# EAGLE design Attenuverting Mixer Slim main v1 (EAGLE 7.7.0)
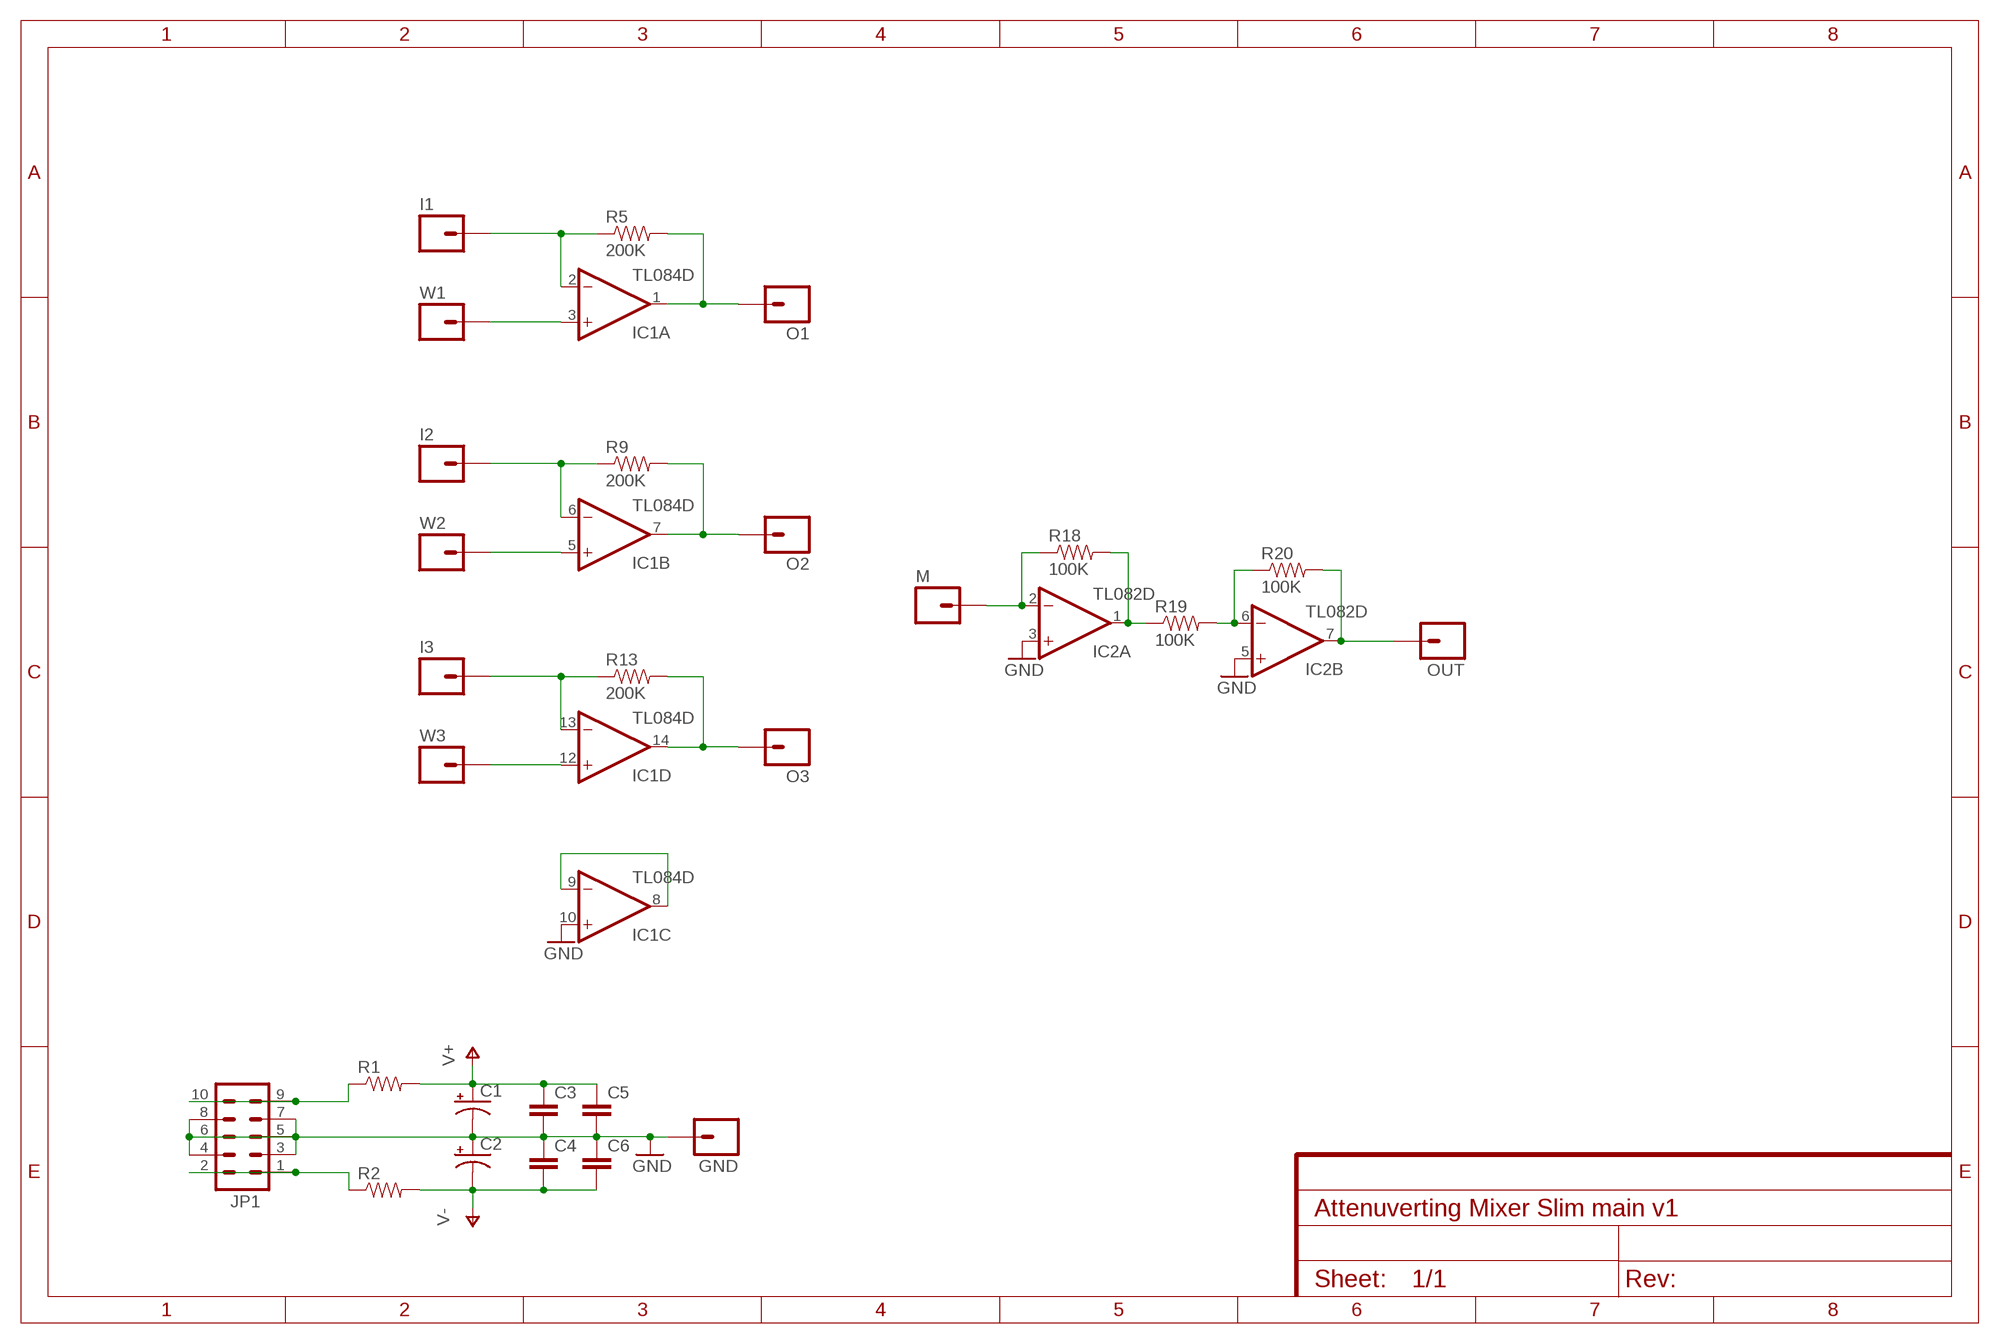
[diagram p0: schematic, sheet 1]

## Parts
C1  CAP_POLC  [PANASONIC_C]
C2  CAP_POLC  [PANASONIC_C]
C3  CAP0603-CAP  [0603-CAP]
C4  CAP0603-CAP  [0603-CAP]
C5  CAP0603-CAP  [0603-CAP]
C6  CAP0603-CAP  [0603-CAP]
GND  M01PTH  [1X01]
I1  M01PTH  [1X01]
I2  M01PTH  [1X01]
I3  M01PTH  [1X01]
IC1  TL084D  [SO14]
IC2  TL082D  [SO08]
JP1  M05X2PTH  [AVR_ICSP]
M  M01PTH  [1X01]
O1  M01PTH  [1X01]
O2  M01PTH  [1X01]
O3  M01PTH  [1X01]
OUT  M01PTH  [1X01]
R1  RESISTOR0805-RES  [0805]
R2  RESISTOR0805-RES  [0805]
R5  200K  RESISTOR0603-RES  [0603-RES]
R9  200K  RESISTOR0603-RES  [0603-RES]
R13  200K  RESISTOR0603-RES  [0603-RES]
R18  100K  RESISTOR0603-RES  [0603-RES]
R19  100K  RESISTOR0603-RES  [0603-RES]
R20  100K  RESISTOR0603-RES  [0603-RES]
W1  M01PTH  [1X01]
W2  M01PTH  [1X01]
W3  M01PTH  [1X01]

## Nets
GND: C1.- C2.+ C3.2 C4.1 C5.2 C6.1 GND.1 IC1.10(C:+IN) IC2.3(A:+IN) IC2.5(B:+IN) JP1.3 JP1.4 JP1.5 JP1.6 JP1.7 JP1.8
N$1: IC1.3(A:+IN) W1.1
N$2: I1.1 IC1.2(A:-IN) R5.1
N$3: JP1.1 JP1.2 R2.1
N$4: JP1.9 JP1.10 R1.1
N$8: IC1.1(A:OUT) O1.1 R5.2
N$9: IC1.5(B:+IN) W2.1
N$10: IC1.12(D:+IN) W3.1
N$11: I2.1 IC1.6(B:-IN) R9.1
N$13: IC1.7(B:OUT) O2.1 R9.2
N$16: I3.1 IC1.13(D:-IN) R13.1
N$17: IC1.14(D:OUT) O3.1 R13.2
N$21: IC2.2(A:-IN) M.1 R18.1
N$22: IC2.1(A:OUT) R18.2 R19.1
N$23: IC2.6(B:-IN) R19.2 R20.1
N$24: IC2.7(B:OUT) OUT.1 R20.2
N$26: IC1.8(C:OUT) IC1.9(C:-IN)
V+: C1.+ C3.1 C5.1 R1.2
V-: C2.- C4.2 C6.2 R2.2

## Power pins joined to a net without a drawn wire
V+: IC1.4(P:V+) IC2.8(P:V+)
V-: IC1.11(P:V-) IC2.4(P:V-)

## Library data of the parts
C1 C2 = SparkFun-Capacitors:CAP_POL: Capacitor Polarized These are standard SMD and PTH capacitors. Normally 10uF, 47uF, and 100uF in electrolytic and tantalum varieties. Always verify the external diameter of the through hole cap, it varies with capacity, voltage, and manufacturer. The EIA devices should be standard.
C3-C6 = SparkFun-Passives:CAP: Capacitor Standard 0603 ceramic capacitor, and 0.1" leaded capacitor.
GND I1-I3 M O1-O3 OUT W1-W3 = SparkFun-Connectors:M01: Header 1 Standard 1-pin 0.1" header. Use with straight break away headers (SKU : PRT-00116), right angle break away headers (PRT-00553), swiss pins (PRT-00743), machine pins (PRT-00117), and female headers (PRT-00115).
IC1 = linear:TL084: OP AMP
IC2 = linear:TL082: OP AMP Data sheet <http://www.ti.com/lit/ds/symlink/tl084a . pdf>; DATA_SHEET: <a href="http://www.ti.com/lit/ds/symlink/tl084a.pdf"> Data sheet </a>
JP1 = SparkFun-Connectors:M05X2: Header 5x2 Standard 10-pin dual row 0.1" header. Commonly used with AVR-ISP. Use with Spark Fun Electronics SKU: PRT-00778
R1 R2 = SparkFun-Resistors:RESISTOR: Resistor Basic schematic elements and footprints for 0603, 1206, and PTH resistors.
R5 R9 R13 R18-R20 = SparkFun-Passives:RESISTOR: Resistor Basic schematic elements and footprints for 0603, 1206, and PTH resistors.

## Board
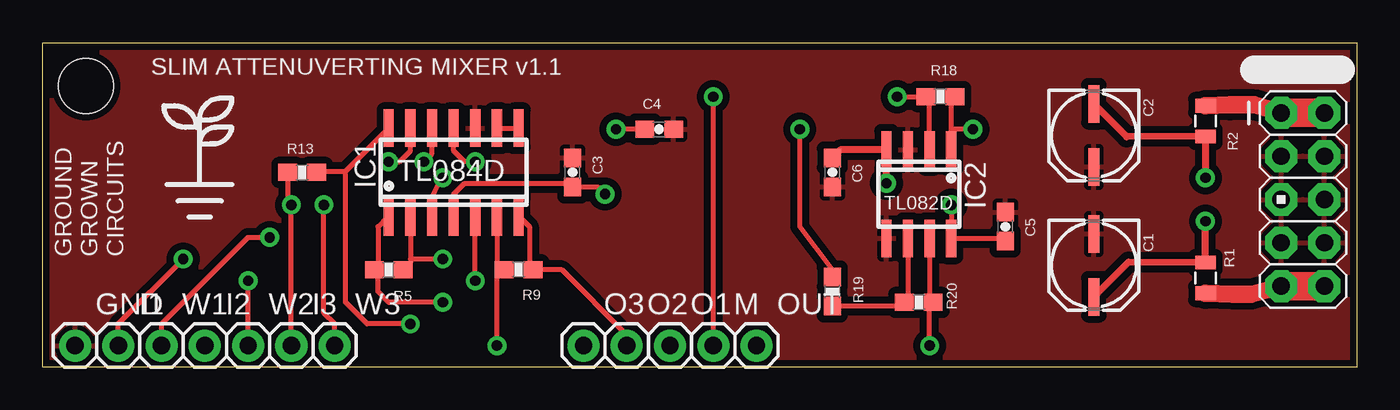
[diagram p1: board, top side]
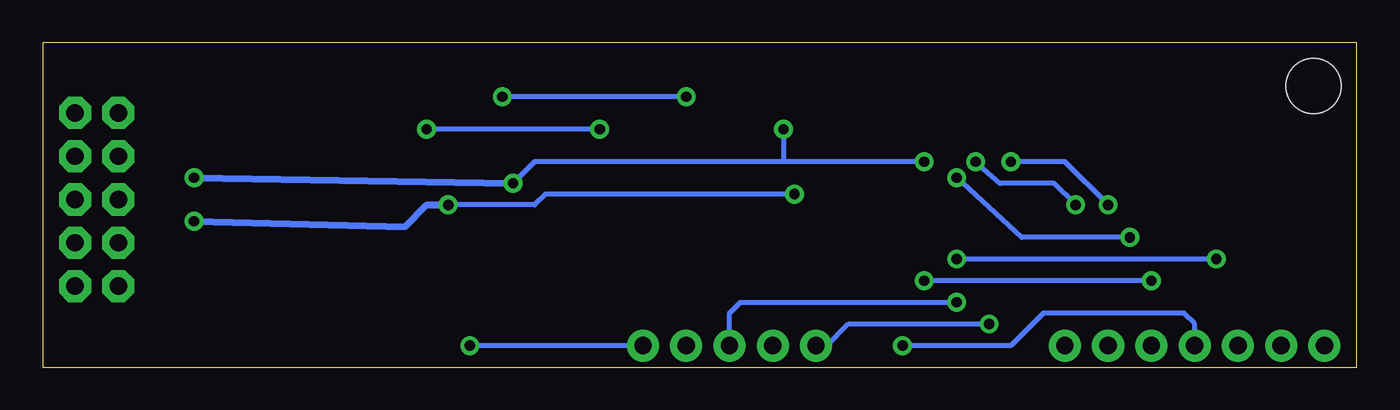
[diagram p2: board, bottom side, seen from below]

Size 77.15 x 19.05 mm. Coordinates in mm from the lower left corner, seen from the top.
Outline: 0,0 0,19.05 77.15,19.05 77.15,0 0,0
Copper layers (1*16): Top 0.035mm / dielectric 1.5mm / Bottom 0.035mm
Design rules "SparkFun": minimum track width 8mil, minimum drill 20mil, track to track 8mil, track to pad 8mil, pad to pad 8mil, via to via 8mil, smd to smd 8mil, copper to edge 8mil, drill to drill 8mil, minimum pad ring 12mil, minimum via ring 10mil, stop-mask expansion 4mil, vias tented up to drill 20mil, thermal gap 10mil
Holes 3.2 mm at 2.54,16.51

### Footprints (pad centres in the part's own frame; a part is rotated, then mirrored left to right if it is on the bottom)
PANASONIC_C = smd 2.2 x 0.65: + 1.9,-0.2; - -1.8,-0.2
0603-CAP = smd 1.1 x 1: 1 -0.85,0; 2 0.85,0
1X01 = drill 1.016 pad 1.88: 1 0,0
SO14 = smd 0.6 x 2.2: 1 -3.81,-2.6; 2 -2.54,-2.6; 3 -1.27,-2.6; 4 0,-2.6; 5 1.27,-2.6; 6 2.54,-2.6; 7 3.81,-2.6; 8 3.81,2.6; 9 2.54,2.6; 10 1.27,2.6; 11 0,2.6; 12 -1.27,2.6; 13 -2.54,2.6; 14 -3.81,2.6
SO08 = smd 0.6 x 2.2: 1 -1.905,-2.6; 2 -0.635,-2.6; 3 0.635,-2.6; 4 1.905,-2.6; 5 1.905,2.6; 6 0.635,2.6; 7 -0.635,2.6; 8 -1.905,2.6
AVR_ICSP = drill 1.016 pad 1.88 octagon: 1 -1.27,5.08; 2 1.27,5.08; 3 -1.27,2.54; 4 1.27,2.54; 5 -1.27,0; 6 1.27,0; 7 -1.27,-2.54; 8 1.27,-2.54; 9 -1.27,-5.08; 10 1.27,-5.08
0805 = smd 0.8 x 1.2: 1 -0.9,0; 2 0.9,0
0603-RES = smd 1.1 x 1: 1 -0.85,0; 2 0.85,0

### Placement (x,y rotation side)
C1  61.91,6.03 270 top
C2  61.91,13.65 270 top
C3  31.11,11.43 90 top
C4  36.2,13.97 180 top
C5  56.52,8.26 90 top
C6  46.36,11.43 90 top
GND  1.91,1.27 0 top
I1  4.44,1.27 0 top
I2  9.53,1.27 0 top
I3  14.61,1.27 0 top
IC1  24.13,11.43 0 top
IC2  51.44,10.16 180 top
JP1  73.98,9.84 0 top
M  39.37,1.27 0 top
O1  36.83,1.27 0 top
O2  34.29,1.27 0 top
O3  31.75,1.27 0 top
OUT  41.91,1.27 0 top
R1  68.26,5.24 90 top
R2  68.26,14.45 270 top
R5  20.32,5.71 180 top
R9  27.94,5.71 0 top
R13  15.24,11.43 0 top
R18  52.71,15.88 0 top
R19  46.36,4.44 270 top
R20  51.44,3.81 0 top
U$1  [LOGO_SMALL]  9.21,10.79 0 top
W1  6.98,1.27 0 top
W2  12.07,1.27 0 top
W3  17.14,1.27 0 top

### Tracks (layer width: path | path; a pad name or v marks a point on that pad's centre or on a via)
GND
  pour Top (isolate 0.406): 0.32,0 0.32,19.05 77.15,19.05 77.15,0
N$1  (via drill 0.6)
  Top 0.305: W1.1 6.99,2.54 12.07,7.62 v13.34,7.62 | v23.5,11.11 23.18,10.64 22.86,10 IC1.3
  Bottom 0.305: v13.34,7.62 19.69,7.62 v23.5,11.11
N$2  (via drill 0.6)
  Top 0.305: IC1.2 21.59,6.35 | 21.59,6.35 21.59,6.14 R5.1 | I1.1 4.45,2.54 v8.26,6.35 | v23.5,6.35 21.59,6.35
  Bottom 0.305: v8.26,6.35 v23.5,6.35
N$3
  Top 1.016: JP1.1 71.12,15.4 69.72,15.4 R2.1
  Top 1.676: JP1.2 JP1.1
N$4
  Top 1.016: JP1.9 70.96,4.29 69.88,4.29 R1.1
  Top 1.676: JP1.10 JP1.9
N$8  (via drill 0.6)
  Top 0.305: IC1.1 20.26,8.83 19.69,8.26 19.69,5.93 R5.2 19.69,5.5 19.69,4.45 20.32,3.81 v23.5,3.81
  Bottom 0.305: O1.1 36.83,3.18 36.2,3.81 v23.5,3.81
N$9  (via drill 0.6)
  Top 0.305: W2.1 v12.07,5.08 | v25.4,5.08 IC1.5
  Bottom 0.305: v12.07,5.08 v25.4,5.08
N$10  (via drill 0.6)
  Top 0.305: v22.38,12.07 22.86,12.54 IC1.12 | W3.1 17.15,2.54 16.51,3.18 v16.51,9.53
  Bottom 0.305: v16.51,9.53 17.78,10.8 20.96,10.8 v22.38,12.07
N$11  (via drill 0.6)
  Top 0.305: IC1.6 26.67,6.14 R9.1 26.67,5.3 v26.67,1.27
  Bottom 0.305: I2.1 9.53,2.54 10.16,3.18 18.42,3.18 20.32,1.27 v26.67,1.27
N$13
  Top 0.305: O2.1 34.29,1.91 30.48,5.72 R9.2 28.58,5.93 28.58,8.26 28,8.83 IC1.7
N$16  (via drill 0.6)
  Top 0.305: I3.1 v14.61,9.53 14.39,9.74 R13.1 | v20.32,12.07 20.96,12.07 21.59,12.7 IC1.13
  Bottom 0.305: v14.61,9.53 17.15,12.07 v20.32,12.07
N$17  (via drill 0.6)
  Top 0.305: v21.59,2.54 19.05,2.54 17.78,3.81 17.78,11.49 | 17.78,11.49 IC1.14 | 17.78,11.49 16.09,11.49 R13.2
  Bottom 0.305: O3.1 31.12,1.27 29.85,2.54 v21.59,2.54
N$21  (via drill 0.6)
  Top 0.305: M.1 v39.37,15.88 | v50.17,15.88 R18.1 52.07,15.66 IC2.2
  Bottom 0.305: v39.37,15.88 v50.17,15.88
N$22  (via drill 0.6)
  Top 0.305: R19.1 46.36,5.72 44.45,8.26 v44.45,13.97 | v54.61,13.97 53.34,13.97 IC2.1 53.34,15.66 R18.2
  Bottom 0.305: v44.45,13.97 v54.61,13.97
N$23
  Top 0.305: IC2.6 50.8,4.03 R20.1 50.37,3.6 R19.2
N$24  (via drill 0.6)
  Top 0.305: IC2.7 52.07,4.03 R20.2 52.07,3.6 v52.07,1.27
  Bottom 0.305: OUT.1 v52.07,1.27
N$26
  Top 0.305: IC1.9 IC1.8
V+  (via drill 0.6)
  Top 0.305: IC1.4 24.13,10.16 24.77,10.8 30.9,10.8 C3.1 32.6,10.58 v33.02,10.16 | v53.34,9.53 IC2.8 56.36,7.56 C5.1
  Top 0.406: v68.26,8.57 R1.2 63.74,6.16 C1.+
  Bottom 0.305: v33.02,10.16 47.63,10.16 48.26,9.53 v53.34,9.53
  Bottom 0.406: v68.26,8.57 55.88,8.26 54.61,9.53 v53.34,9.53
V-  (via drill 0.6)
  Top 0.305: v25.4,12.07 24.77,12.07 24.13,12.7 IC1.11 | C4.2 v33.66,13.97
  Top 0.406: v68.26,11.11 R2.2 63.64,13.52 C2.- | v49.53,10.8 IC2.4 46.84,12.76 C6.2
  Bottom 0.305: v25.4,12.07 33.66,12.07 | 33.66,12.07 48.26,12.07 v49.53,10.8 | v33.66,13.97 33.66,12.07
  Bottom 0.406: v68.26,11.11 v49.53,10.8

### Text on the board
tPlace: SLIM ATTENUVERTING MIXER v1.1 | GROUND / GROWN / CIRCUITS